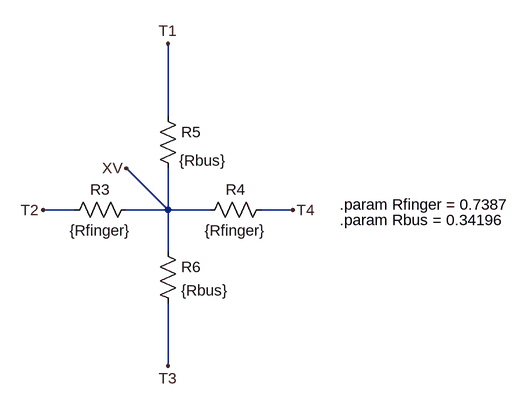
[diagram p0: schematic IVTopElement.asc]
IVTopElement.asc, the LTspice schematic file:
Version 4
SHEET 1 880 704
WIRE 176 96 176 -16
WIRE 32 240 -16 240
WIRE 176 240 112 176
WIRE 176 240 176 176
WIRE 176 240 112 240
WIRE 240 240 176 240
WIRE 368 240 320 240
WIRE 176 304 176 240
WIRE 176 480 176 384
FLAG 176 -16 T1
FLAG 176 480 T3
FLAG -16 240 T2
FLAG 368 240 T4
FLAG 112 176 XV
SYMBOL res 128 224 R90
WINDOW 0 0 56 VBottom 2
WINDOW 3 32 56 VTop 2
SYMATTR InstName R3
SYMATTR Value {Rfinger}
SYMBOL res 336 224 R90
WINDOW 0 0 56 VBottom 2
WINDOW 3 32 56 VTop 2
SYMATTR InstName R4
SYMATTR Value {Rfinger}
SYMBOL res 160 80 R0
WINDOW 3 33 84 Left 2
SYMATTR Value {Rbus}
SYMATTR InstName R5
SYMBOL res 160 288 R0
SYMATTR InstName R6
SYMATTR Value {Rbus}
TEXT 440 232 Left 2 !.param Rfinger = 0.7387
TEXT 440 256 Left 2 !.param Rbus = 0.34196

The netlist it stands for:
* IVTopElement.asc
R3 XV T2 {Rfinger}
R4 T4 XV {Rfinger}
R5 T1 XV {Rbus}
R6 XV T3 {Rbus}
.param Rfinger = 0.7387
.param Rbus = 0.34196
.backanno
.end